# Altium project TL084.PrjPcb
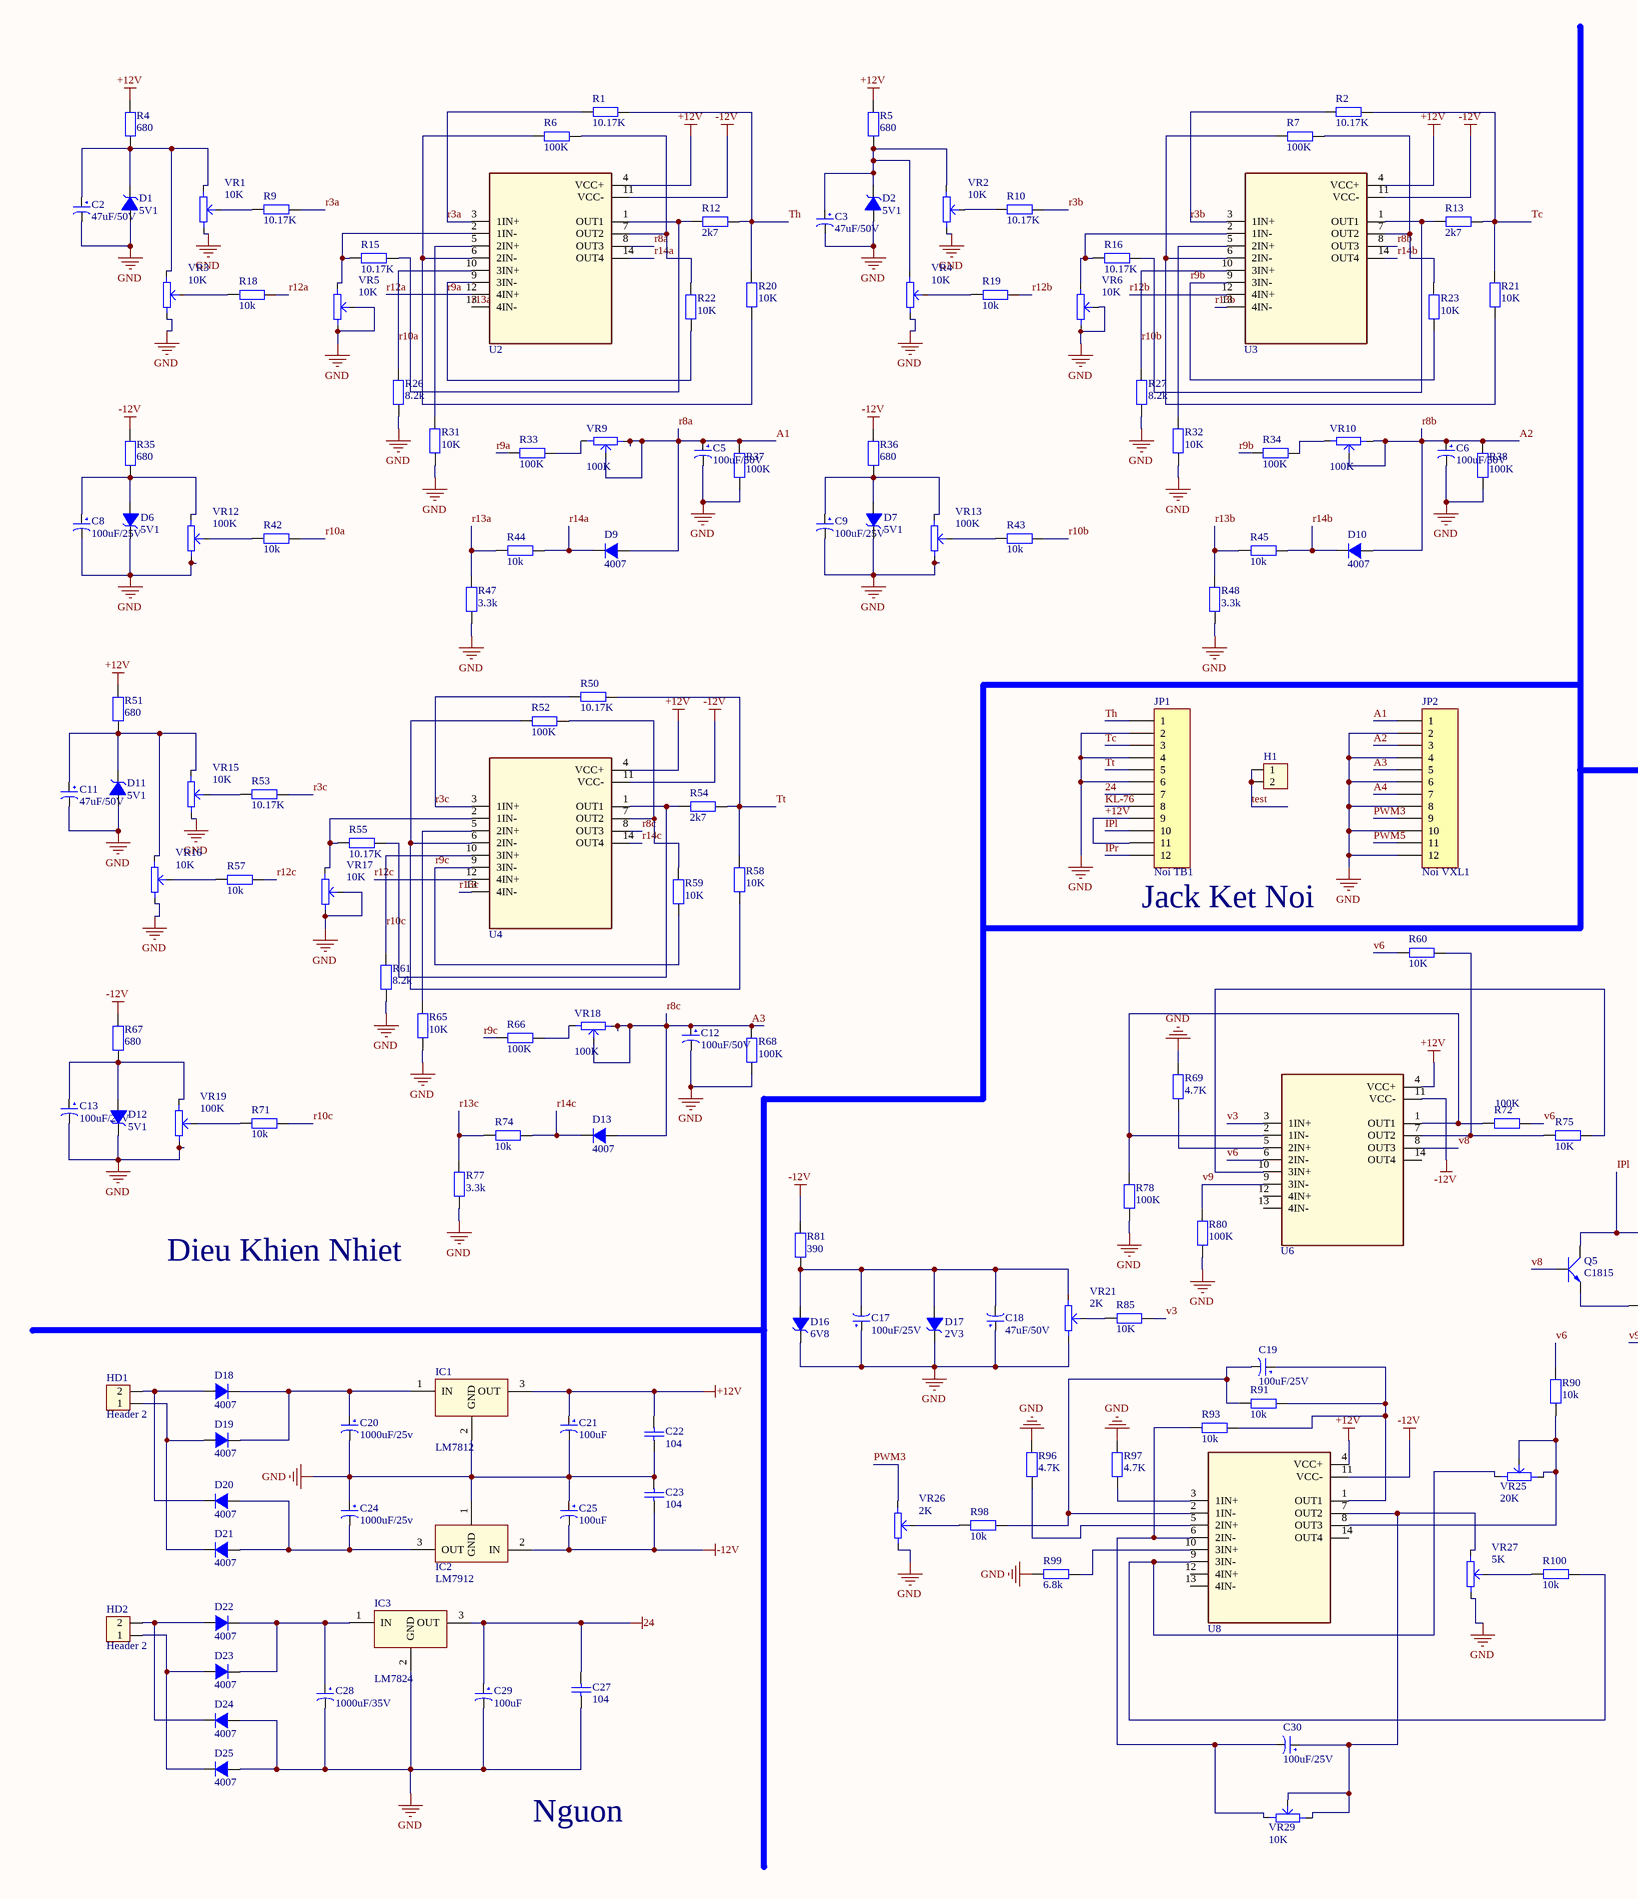
[diagram p0: SCH.SchDoc, left]
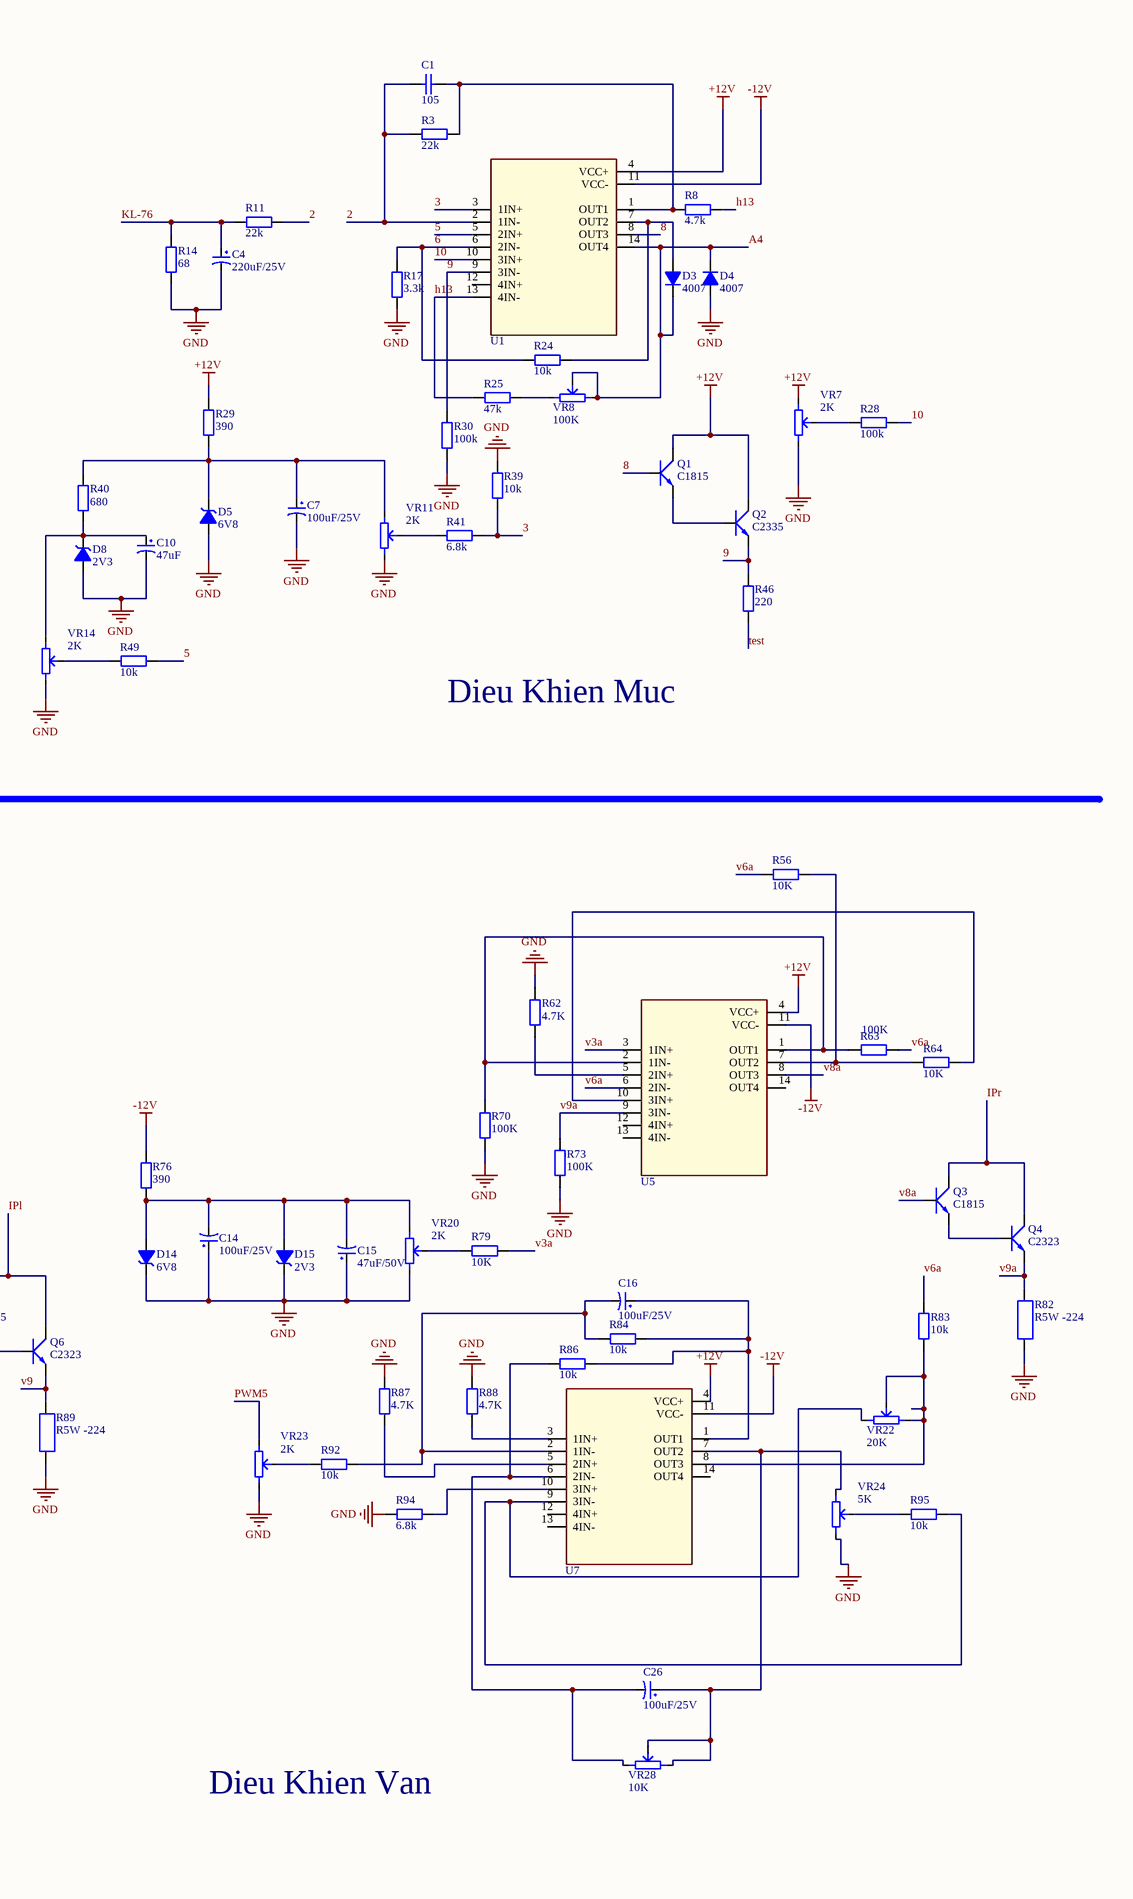
[diagram p1: SCH.SchDoc, right]
1 sheet, 206 parts. Net scope: global (net labels, ports and power ports of the same name join across sheets).
Board file: PCB.PcbDoc

## Sheet SCH.SchDoc
size A2; SheetNumber: 1; SheetTotal: 1

### Parts
C1  105  [tu gom]
C2  47uF/50V  [tu hoa 6.5mm]
C3  47uF/50V  [tu hoa 6.5mm]
C4  220uF/25V  [Tu hoa 8mm]
C5  100uF/50V  [tu hoa 8mm]
C6  100uF/50V  [tu hoa 8mm]
C7  100uF/25V  [tu hoa 5mm]
C8  100uF/25V  [tu hoa 5mm]
C9  100uF/25V  [tu hoa 5mm]
C10  47uF  [tu hoa 5mm]
C11  47uF/50V  [tu hoa 6.5mm]
C12  100uF/50V  [tu hoa 8mm]
C13  100uF/25V  [tu hoa 5mm]
C14  100uF/25V  [tu hoa 5mm]
C15  47uF/50V  [tu hoa 6.5mm]
C16  100uF/25V  [tu hoa 5mm]
C17  100uF/25V  [tu hoa 5mm]
C18  47uF/50V  [tu hoa 6.5mm]
C19  100uF/25V  [tu hoa 5mm]
C20  1000uF/25v  [tu hoa 13mm]
C21  100uF  [tu hoa 5mm]
C22  104  [tu gom]
C23  104  [tu gom]
C24  1000uF/25v  [tu hoa 13mm]
C25  100uF  [tu hoa 5mm]
C26  100uF/25V  [tu hoa 5mm]
C27  104  [tu gom]
C28  1000uF/35V  [tu hoa 13mm]
C29  100uF  [tu hoa 6.5mm]
C30  100uF/25V  [tu hoa 5mm]
D1  5V1  [DZ0.5A]
D2  5V1  [DZ0.5A]
D3  4007  [DIODE 1A]
D4  4007  [DIODE 1A]
D5  6V8  [DZ0.5A]
D6  5V1  [DZ0.5A]
D7  5V1  [DZ0.5A]
D8  2V3  [DZ0.5A]
D9  4007  [DIODE 1A]
D10  4007  [DIODE 1A]
D11  5V1  [DZ0.5A]
D12  5V1  [DZ0.5A]
D13  4007  [DIODE 1A]
D14  6V8  [DZ0.5A]
D15  2V3  [DZ0.5A]
D16  6V8  [DZ0.5A]
D17  2V3  [DZ0.5A]
D18  4007  [DIODE 1A]
D19  4007  [DIODE 1A]
D20  4007  [DIODE 1A]
D21  4007  [DIODE 1A]
D22  4007  [DIODE 1A]
D23  4007  [DIODE 1A]
D24  4007  [DIODE 1A]
D25  4007  [DIODE 1A]
H1  Header 2P 2.54 Duc Thang  [XH2.54M-2]  (value not drawn)
HD1  Header 2  [HED2]
HD2  Header 2  [HED2]
IC1  LM7812  [QTO-220]
IC2  LM7912  [QTO-220]
IC3  LM7824  [QTO-220]
JP1  Noi TB1  [JP12-D1T]
JP2  Noi VXL1  [JP12-D1T]
Q1  C1815  [QTO-92]
Q2  C2335  [QTO-92]
Q3  C1815  [QTO-92]
Q4  C2323  [QTO-92]
Q5  C1815  [QTO-92]
Q6  C2323  [QTO-92]
R1  10.17K  [R1/4W]
R2  10.17K  [R1/4W]
R3  22k  [R1/4W]
R4  680  [R1/4W]
R5  680  [R1/4W]
R6  100K  [R1/4W]
R7  100K  [R1/4W]
R8  4.7k  [R1/4W]
R9  10.17K  [R1/4W]
R10  10.17K  [R1/4W]
R11  22k  [R1/4W]
R12  2k7  [R1/4W]
R13  2k7  [R1/4W]
R14  68  [Tro cong suat 10W]
R15  10.17K  [R1/4W]
R16  10.17K  [R1/4W]
R17  3.3k  [R1/4W]
R18  10k  [R1/4W]
R19  10k  [R1/4W]
R20  10K  [R1/4W]
R21  10K  [R1/4W]
R22  10K  [R1/4W]
R23  10K  [R1/4W]
R24  10k  [R1/4W]
R25  47k  [R1/4W]
R26  8.2k  [R1/4W]
R27  8.2k  [R1/4W]
R28  100k  [R1/4W]
R29  390  [R1/4W]
R30  100k  [R1/4W]
R31  10K  [R1/4W]
R32  10K  [R1/4W]
R33  100K  [R1/4W]
R34  100K  [R1/4W]
R35  680  [R1/4W]
R36  680  [R1/4W]
R37  100K  [R1/4W]
R38  100K  [R1/4W]
R39  10k  [R1/4W]
R40  680  [R1/4W]
R41  6.8k  [R1/4W]
R42  10k  [R1/4W]
R43  10k  [R1/4W]
R44  10k  [R1/4W]
R45  10k  [R1/4W]
R46  220  [Tro cong suat 5W]
R47  3.3k  [R1/4W]
R48  3.3k  [R1/4W]
R49  10k  [R1/4W]
R50  10.17K  [R1/4W]
R51  680  [R1/4W]
R52  100K  [R1/4W]
R53  10.17K  [R1/4W]
R54  2k7  [R1/4W]
R55  10.17K  [R1/4W]
R56  10K  [R1/4W]
R57  10k  [R1/4W]
R58  10K  [R1/4W]
R59  10K  [R1/4W]
R60  10K  [R1/4W]
R61  8.2k  [R1/4W]
R62  4.7K  [R1/4W]
R63  100K  [R1/4W]
R64  10K  [R1/4W]
R65  10K  [R1/4W]
R66  100K  [R1/4W]
R67  680  [R1/4W]
R68  100K  [R1/4W]
R69  4.7K  [R1/4W]
R70  100K  [R1/4W]
R71  10k  [R1/4W]
R72  100K  [R1/4W]
R73  100K  [R1/4W]
R74  10k  [R1/4W]
R75  10K  [R1/4W]
R76  390  [R1/4W]
R77  3.3k  [R1/4W]
R78  100K  [R1/4W]
R79  10K  [R1/4W]
R80  100K  [R1/4W]
R81  390  [R1/4W]
R82  R5W -224  [R5W]
R83  10k  [R1/4W]
R84  10k  [R1/4W]
R85  10K  [R1/4W]
R86  10k  [R1/4W]
R87  4.7K  [R1/4W]
R88  4.7K  [R1/4W]
R89  R5W -224  [R5W]
R90  10k  [R1/4W]
R91  10k  [R1/4W]
R92  10k  [R1/4W]
R93  10k  [R1/4W]
R94  6.8k  [R1/4W]
R95  10k  [R1/4W]
R96  4.7K  [R1/4W]
R97  4.7K  [R1/4W]
R98  10k  [R1/4W]
R99  6.8k  [R1/4W]
R100  10k  [R1/4W]
U1  TL084  [TL084]  (value not drawn)
U2  TL084  [TL084]  (value not drawn)
U3  TL084  [TL084]  (value not drawn)
U4  TL084  [TL084]  (value not drawn)
U5  TL084  [TL084]  (value not drawn)
U6  TL084  [TL084]  (value not drawn)
U7  TL084  [TL084]  (value not drawn)
U8  TL084  [TL084]  (value not drawn)
VR1  10K  [Bien tro tam giac-DIP nam]
VR2  10K  [Bien tro tam giac-DIP nam]
VR3  10K  [Bien tro tam giac-DIP nam]
VR4  10K  [Bien tro tam giac-DIP nam]
VR5  10K  [Bien tro tam giac-DIP nam]
VR6  10K  [Bien tro tam giac-DIP nam]
VR7  2K  [Bien tro tam giac-DIP nam]
VR8  100K  [Bien tro tam giac-DIP nam]
VR9  100K  [Bien tro tam giac-DIP nam]
VR10  100K  [Bien tro tam giac-DIP nam]
VR11  2K  [Bien tro tam giac-DIP nam]
VR12  100K  [Bien tro tam giac-DIP nam]
VR13  100K  [Bien tro tam giac-DIP nam]
VR14  2K  [Bien tro tam giac-DIP nam]
VR15  10K  [Bien tro tam giac-DIP nam]
VR16  10K  [Bien tro tam giac-DIP nam]
VR17  10K  [Bien tro tam giac-DIP nam]
VR18  100K  [Bien tro tam giac-DIP nam]
VR19  100K  [Bien tro tam giac-DIP nam]
VR20  2K  [Bien tro tam giac-DIP nam]
VR21  2K  [Bien tro tam giac-DIP nam]
VR22  20K  [Bien tro tam giac-DIP nam]
VR23  2K  [Bien tro tam giac-DIP nam]
VR24  5K  [Bien tro tam giac-DIP nam]
VR25  20K  [Bien tro tam giac-DIP nam]
VR26  2K  [Bien tro tam giac-DIP nam]
VR27  5K  [Bien tro tam giac-DIP nam]
VR28  10K  [Bien tro tam giac-DIP nam]
VR29  10K  [Bien tro tam giac-DIP nam]

### Nets
24: C27.1 C29.1 IC3.3(OUT) JP1.7
+12V: C21.1 C22.1 IC1.3(OUT) JP1.9 JP1.11 Q1.2(C) Q2.2(C) R4.2 R5.2 R29.2 R51.2 U1.4(VCC+) U2.4(VCC+) U3.4(VCC+) U4.4(VCC+) U5.4(VCC+) U6.4(VCC+) U7.4(VCC+) U8.4(VCC+) VR7.1
-12V: C23.2 C25.2 IC2.2(IN) R35.1 R36.1 R67.1 R76.2 R81.2 U1.11(VCC-) U2.11(VCC-) U3.11(VCC-) U4.11(VCC-) U5.11(VCC-) U6.11(VCC-) U7.11(VCC-) U8.11(VCC-)
GND: C2.2 C3.2 C4.2 C5.2 C6.2 C7.2 C8.2 C9.2 C10.2 C11.2 C12.2 C13.2 C14.1 C15.1 C17.1 C18.1 C20.2 C21.2 C22.2 C23.1 C24.1 C25.1 C27.2 C28.2 C29.2 D1.1(A) D2.1(A) D4.1(A) D5.1(A) D6.2(K) D7.2(K) D8.1(A) D11.1(A) D12.2(K) D14.2(K) D15.2(K) D16.2(K) D17.2(K) D24.1(A) D25.1(A) IC1.2(GND) IC2.1(GND) IC3.2(GND) JP1.2 JP1.4 JP1.6 JP2.2 JP2.4 JP2.6 JP2.8 JP2.10 JP2.12 R14.1 R17.1 R26.1 R27.1 R30.1 R31.1 R32.1 R37.1 R38.1 R39.2 R47.1 R48.1 R61.1 R62.2 R65.1 R68.1 R69.2 R70.1 R73.1 R77.1 R78.1 R80.1 R82.1 R87.2 R88.2 R89.1 R94.1 R96.2 R97.2 R99.1 VR1.3 VR2.3 VR3.3 VR4.3 VR5.2 VR5.3 VR6.2 VR6.3 VR7.3 VR11.3 VR12.3 VR13.3 VR14.3 VR15.3 VR16.3 VR17.2 VR17.3 VR19.3 VR20.3 VR21.3 VR23.3 VR24.3 VR26.3 VR27.3
2: C1.2 R3.1 R11.2 U1.2(1IN-)
3: R39.1 R41.2 U1.3(1IN+)
5: R49.1 U1.5(2IN+)
6: R17.2 R24.2 U1.6(2IN-)
8: Q1.3(B) U1.8(OUT3)
9: Q2.1(E) R30.2 R46.2 U1.9(3IN-)
10: R28.1 U1.10(3IN+)
A1: C5.1 D9.1(A) JP2.1 R37.2 U2.8(OUT3) VR9.1 VR9.2  [also labelled r8a]
A2: C6.1 D10.1(A) JP2.3 R38.2 U3.8(OUT3) VR10.1 VR10.2  [also labelled r8b]
A3: C12.1 D13.1(A) JP2.5 R68.2 U4.8(OUT3) VR18.1 VR18.2  [also labelled r8c]
A4: D3.2(K) D4.2(K) JP2.7 U1.14(OUT4) VR8.2 VR8.3
h13: R8.2 R25.2 U1.13(4IN-)
IPl: JP1.10 Q5.2(C) Q6.2(C)
IPr: JP1.12 Q3.2(C) Q4.2(C)
KL-76: C4.1 JP1.8 R11.1 R14.2
PWM3: JP2.9 VR26.1
PWM5: JP2.11 VR23.1
r3a: R1.2 R9.2 U2.3(1IN+)
r3b: R2.2 R10.2 U3.3(1IN+)
r3c: R50.2 R53.2 U4.3(1IN+)
r9b: R23.1 R34.1 U3.9(3IN-)
r9c: R59.1 R66.1 U4.9(3IN-)
r10a: R26.2 R42.2 U2.10(3IN+)
r10b: R27.2 R43.2 U3.10(3IN+)
r10c: R61.2 R71.2 U4.10(3IN+)
r12a: R18.1 R22.1 R33.1 U2.9(3IN-) U2.12(4IN+)  [also labelled r9a]
r12b: R19.1 U3.12(4IN+)
r12c: R57.1 U4.12(4IN+)
r13a: R44.2 R47.2 U2.13(4IN-)
r13b: R45.2 R48.2 U3.13(4IN-)
r13c: R74.2 R77.2 U4.13(4IN-)
r14a: D9.2(K) R44.1 U2.14(OUT4)
r14b: D10.2(K) R45.1 U3.14(OUT4)
r14c: D13.2(K) R74.1 U4.14(OUT4)
Tc: JP1.3 R2.1 R13.2 R21.2
test: H1.1 H1.2 R46.1
Th: JP1.1 R1.1 R12.2 R20.2
Tt: JP1.5 R50.1 R54.2 R58.2
v3: R85.2 U6.3(1IN+)
v3a: R79.2 U5.3(1IN+)
v6: R60.1 R72.2 R90.2 U6.6(2IN-)
v6a: R56.1 R63.2 R83.2 U5.6(2IN-)
v8: Q5.3(B) U6.8(OUT3)
v8a: Q3.3(B) U5.8(OUT3)
v9: Q6.1(E) R80.2 R89.2 U6.9(3IN-)
v9a: Q4.1(E) R73.2 R82.2 U5.9(3IN-)
NetC1_1: C1.1 R3.2 R8.1 U1.1(OUT1)
NetC2_1: C2.1 D1.2(K) R4.1 VR1.1 VR3.1
NetC3_1: C3.1 D2.2(K) R5.1 VR2.1 VR4.1
NetC7_1: C7.1 D5.2(K) R29.1 R40.2 VR11.1
NetC8_1: C8.1 D6.1(A) R35.2 VR12.1
NetC9_1: C9.1 D7.1(A) R36.2 VR13.1
NetC10_1: C10.1 D8.2(K) R40.1 VR14.1
NetC11_1: C11.1 D11.2(K) R51.1 VR15.1 VR16.1
NetC13_1: C13.1 D12.1(A) R67.2 VR19.1
NetC14_2: C14.2 C15.2 D14.1(A) D15.1(A) R76.1 VR20.1
NetC16_1: C16.1 R84.2 R86.2 U7.1(OUT1)
NetC16_2: C16.2 R84.1 R92.2 U7.2(1IN-)
NetC17_2: C17.2 C18.2 D16.1(A) D17.1(A) R81.1 VR21.1
NetC19_1: C19.1 R91.2 R93.2 U8.1(OUT1)
NetC19_2: C19.2 R91.1 R98.2 U8.2(1IN-)
NetC20_1: C20.1 D18.2(K) D19.2(K) IC1.1(IN)
NetC24_2: C24.2 D20.1(A) D21.1(A) IC2.3(OUT)
NetC26_1: C26.1 U7.7(OUT2) VR24.1 VR28.2 VR28.3
NetC26_2: C26.2 R86.1 U7.6(2IN-) VR28.1
NetC28_1: C28.1 D22.2(K) D23.2(K) IC3.1(IN)
NetC30_1: C30.1 U8.7(OUT2) VR27.1 VR29.2 VR29.3
NetC30_2: C30.2 R93.1 U8.6(2IN-) VR29.1
NetD3_1: D3.1(A) R24.1 U1.7(OUT2)
NetD18_1: D18.1(A) D20.2(K) HD1.2
NetD19_1: D19.1(A) D21.2(K) HD1.1
NetD22_1: D22.1(A) D24.2(K) HD2.2
NetD23_1: D23.1(A) D25.2(K) HD2.1
NetQ1_1: Q1.1(E) Q2.3(B)
NetQ3_1: Q3.1(E) Q4.3(B)
NetQ5_1: Q5.1(E) Q6.3(B)
NetR6_1: R6.1 R20.1 U2.6(2IN-)
NetR6_2: R6.2 R22.2 U2.7(OUT2)
NetR7_1: R7.1 R21.1 U3.6(2IN-)
NetR7_2: R7.2 R23.2 U3.7(OUT2)
NetR9_1: R9.1 VR1.2
NetR10_1: R10.1 VR2.2
NetR12_1: R12.1 R15.2 U2.1(OUT1)
NetR13_1: R13.1 R16.2 U3.1(OUT1)
NetR15_1: R15.1 U2.2(1IN-) VR5.1
NetR16_1: R16.1 U3.2(1IN-) VR6.1
NetR18_2: R18.2 VR3.2
NetR19_2: R19.2 VR4.2
NetR25_1: R25.1 VR8.1
NetR28_2: R28.2 VR7.2
NetR31_2: R31.2 U2.5(2IN+)
NetR32_2: R32.2 U3.5(2IN+)
NetR33_2: R33.2 VR9.3
NetR34_2: R34.2 VR10.3
NetR41_1: R41.1 VR11.2
NetR42_1: R42.1 VR12.2
NetR43_1: R43.1 VR13.2
NetR49_2: R49.2 VR14.2
NetR52_1: R52.1 R58.1 U4.6(2IN-)
NetR52_2: R52.2 R59.2 U4.7(OUT2)
NetR53_1: R53.1 VR15.2
NetR54_1: R54.1 R55.2 U4.1(OUT1)
NetR55_1: R55.1 U4.2(1IN-) VR17.1
NetR56_2: R56.2 R64.1 U5.7(OUT2)
NetR57_2: R57.2 VR16.2
NetR60_2: R60.2 R75.1 U6.7(OUT2)
NetR62_1: R62.1 U5.5(2IN+)
NetR63_1: R63.1 R70.2 U5.1(OUT1) U5.2(1IN-)
NetR64_2: R64.2 U5.10(3IN+)
NetR65_2: R65.2 U4.5(2IN+)
NetR66_2: R66.2 VR18.3
NetR69_1: R69.1 U6.5(2IN+)
NetR71_1: R71.1 VR19.2
NetR72_1: R72.1 R78.2 U6.1(OUT1) U6.2(1IN-)
NetR75_2: R75.2 U6.10(3IN+)
NetR79_1: R79.1 VR20.2
NetR83_1: R83.1 U7.8(OUT3) VR22.2 VR22.3
NetR85_1: R85.1 VR21.2
NetR87_1: R87.1 U7.5(2IN+)
NetR88_1: R88.1 U7.3(1IN+)
NetR90_1: R90.1 U8.8(OUT3) VR25.2 VR25.3
NetR92_1: R92.1 VR23.2
NetR94_2: R94.2 U7.10(3IN+)
NetR95_1: R95.1 U7.9(3IN-) VR22.1
NetR95_2: R95.2 VR24.2
NetR96_1: R96.1 U8.5(2IN+)
NetR97_1: R97.1 U8.3(1IN+)
NetR98_1: R98.1 VR26.2
NetR99_2: R99.2 U8.10(3IN+)
NetR100_1: R100.1 U8.9(3IN-) VR25.1
NetR100_2: R100.2 VR27.2

Not connected (* = marked no-connect by the designer): U1 12(4IN+); U5 12(4IN+) 13(4IN-) 14(OUT4); U6 12(4IN+) 13(4IN-) 14(OUT4); U7 12(4IN+) 13(4IN-) 14(OUT4); U8 12(4IN+) 13(4IN-) 14(OUT4)

### Notes on the sheet
- Dieu Khien Muc
- (near JP1) Jack Ket Noi
- (near R77) Dieu Khien Nhiet
- Dieu Khien Van
- Nguon

### Library data of the parts
C1 C22 C23 C27 = Tu gom 104 50V: Cắm; So_Chan: 2; Ten_Linh_Kien: Tụ gốm 104 100nF 50V; Don_Vi: Con; Ma_Hang: MH004761; Chung_Loai: Cắm; Kieu_Chan: *
C2 C3 C11 C15 C18 = Tu Hoa 47uF 50V 6x11: Cắm; Don_Vi: Con; So_Chan: 2; Ten_Linh_Kien: Tụ Hóa 47uF 50V; Ma_Hang: MH001360; Chung_Loai: Cắm; Kieu_Chan: *
C4 = Tu Hoa 220uF 25V 8x10: Cắm; Don_Vi: Con; So_Chan: 2; Ten_Linh_Kien: Tụ Hóa 220uF 25V 8x10MM; Ma_Hang: MH006864; Chung_Loai: Cắm; Kieu_Chan: *
C5 C6 C12 = Tu Hoa 100uF 50V 8x11: Cắm; Don_Vi: Con; So_Chan: 2; Ten_Linh_Kien: Tụ Hóa 100uF 50V 8x11MM; Ma_Hang: MH006872; Chung_Loai: Cắm; Kieu_Chan: *
C7-C9 C13 C14 C16 C17 C19 C21 C25 C26 C30 = Tu Hoa 100uF 25V 6x11: Cắm; Don_Vi: Con; So_Chan: 2; Ten_Linh_Kien: Tụ Hóa 100uF 25V 6x11MM; Ma_Hang: MH001351; Chung_Loai: Cắm; Kieu_Chan: *
C10 = Tu Hoa 47uF 25V 5x8: Cắm; Don_Vi: Con; So_Chan: 2; Ten_Linh_Kien: Tụ Hóa 47uF 25V; Ma_Hang: MH006860; Chung_Loai: Cắm; Kieu_Chan: *
C20 C24 C28 = Tu Hoa 1000uF 25V 13x21: Cắm; Don_Vi: Con; So_Chan: 2; Ten_Linh_Kien: Tụ Hóa 1000uF 25V 13x21MM; Ma_Hang: MH002315; Chung_Loai: Cắm; Kieu_Chan: *
C29 = Tu Hoa 100uF 35V 6x8: Cắm; Don_Vi: Con; So_Chan: 2; Ten_Linh_Kien: Tụ Hóa 100uF 35V; Ma_Hang: MH006862; Chung_Loai: Cắm; Kieu_Chan: *
D1 D2 D5-D8 D11 D12 D14-D17 = DZ: Diode Zenner; Value: 3v3
D3 D4 D9 D10 D13 D18-D25 = Diode 1N4007: Cắm; Ten_Linh_Kien: Diode 1N4007 1A (DIP); Don_Vi: Con; Ma_Hang: MH001063; Ghi Chu: *; Kieu_Chan: *; Chung_Loai: Cắm
H1 = Header 2P 2.54 Duc Thang: Cắm; Ten_Linh_Kien: Header 2P XH2.54-2P Đực Thẳng; Don_Vi: Con; Ma_Hang: MH001283; Chung_Loai: Cắm
HD1 HD2 = Hed2: Header 2 (Green); Value: Header 2
IC1 IC3 = LM78xx: On ap +, from + 5 to + 24VDC; Value: LM7805
IC2 = LM79xx: On ap -, from - 5 to - 24VDC; Value: LM7905
JP1 JP2 = JP12: WR-PHD 2.54 mm Angled Socket Header; Manufacturer: W¨¹rth Elektronik eiSos GmbH; partNo: 613012143121; ComponentLink1 Description: Manufacturer; ComponentLink2 Description: Datasheet; NoPins: 12; Created Date: 29 March 2013; ComponentLink1URL: http://www.we-online.com; ComponentLink2URL: http://katalog.we-online.de/em/datasheet/6130xx143121.pdf; Created by: Karrer Zheng
Q1 Q3 Q5 = C1815: NPN 600mW, ECB; Value: C1815
Q2 Q4 Q6 = C1815: NPN 600mW, ECB; Value: C1815
R1-R13 R15-R45 R47-R81 R83-R88 R90-R100 = R1/4W: Resistor 1/4W; Value: R1/4W - 1K
R14 = Tro cong suat 10W
R46 = Tro cong suat 5W
R82 R89 = R5W: Resistor 5W; Value: R5W - 0,47R
VR1-VR29 = Bien tro tam giac nam